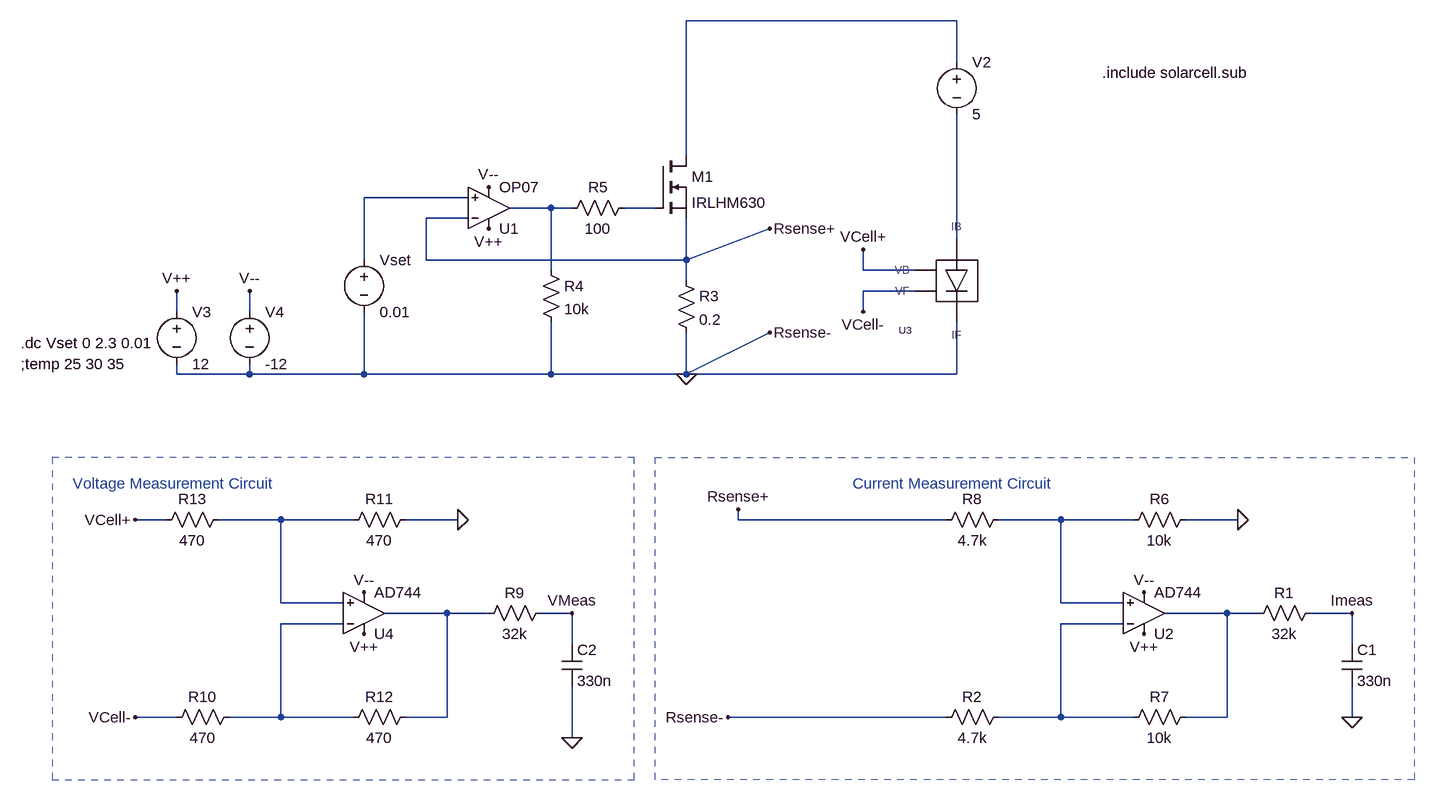
[diagram p0: schematic IVTesterFullCircuit - FIMV.asc]
IVTesterFullCircuit - FIMV.asc, the LTspice schematic file:
Version 4
SHEET 1 1572 1044
WIRE 864 -128 448 -128
WIRE 864 -64 864 -128
WIRE 448 80 448 -128
WIRE 112 144 -48 144
WIRE 240 160 176 160
WIRE 272 160 240 160
WIRE 400 160 352 160
WIRE 112 176 48 176
WIRE 864 208 864 16
WIRE -48 240 -48 144
WIRE 48 240 48 176
WIRE 448 240 448 176
WIRE 448 240 576 192
WIRE 448 240 48 240
WIRE 240 256 240 160
WIRE 720 256 720 224
WIRE 800 256 720 256
WIRE 448 272 448 240
WIRE 800 288 720 288
WIRE -336 320 -336 288
WIRE -224 320 -224 288
WIRE 720 320 720 288
WIRE -336 416 -336 400
WIRE -224 416 -224 400
WIRE -224 416 -336 416
WIRE -48 416 -48 320
WIRE -48 416 -224 416
WIRE 240 416 240 336
WIRE 240 416 -48 416
WIRE 448 416 448 352
WIRE 448 416 576 352
WIRE 448 416 240 416
WIRE 864 416 864 336
WIRE 864 416 448 416
WIRE -352 640 -400 640
WIRE -176 640 -272 640
WIRE -64 640 -176 640
WIRE 96 640 16 640
WIRE 528 640 528 624
WIRE 848 640 528 640
WIRE 1024 640 928 640
WIRE 1136 640 1024 640
WIRE 1296 640 1216 640
WIRE -176 768 -176 640
WIRE -80 768 -176 768
WIRE 1024 768 1024 640
WIRE 1120 768 1024 768
WIRE 80 784 -16 784
WIRE 144 784 80 784
WIRE 272 784 224 784
WIRE 1280 784 1184 784
WIRE 1328 784 1280 784
WIRE 1472 784 1408 784
WIRE -80 800 -176 800
WIRE 1120 800 1024 800
WIRE 272 832 272 784
WIRE 1472 832 1472 784
WIRE -336 944 -400 944
WIRE -176 944 -176 800
WIRE -176 944 -256 944
WIRE -64 944 -176 944
WIRE 80 944 80 784
WIRE 80 944 16 944
WIRE 848 944 512 944
WIRE 1024 944 1024 800
WIRE 1024 944 928 944
WIRE 1136 944 1024 944
WIRE 1280 944 1280 784
WIRE 1280 944 1216 944
WIRE 1472 944 1472 896
WIRE 272 976 272 896
FLAG -336 288 V++
FLAG -224 288 V--
FLAG 144 192 V++
FLAG 144 128 V--
FLAG 448 416 0
FLAG 720 224 VCell+
FLAG 1296 640 0
FLAG 1472 944 0
FLAG 512 944 Rsense-
FLAG 528 624 Rsense+
FLAG 1472 784 Imeas
FLAG 96 640 0
FLAG 272 976 0
FLAG -400 640 VCell+
FLAG 272 784 VMeas
FLAG -400 944 VCell-
FLAG 720 320 VCell-
FLAG 576 192 Rsense+
FLAG 576 352 Rsense-
FLAG -48 816 V++
FLAG 1152 816 V++
FLAG -48 752 V--
FLAG 1152 752 V--
SYMBOL voltage -48 224 R0
WINDOW 123 0 0 Left 0
WINDOW 39 0 0 Left 0
SYMATTR InstName Vset
SYMATTR Value 0.01
SYMBOL voltage 864 -80 R0
WINDOW 123 0 0 Left 0
WINDOW 39 0 0 Left 0
SYMATTR InstName V2
SYMATTR Value 5
SYMBOL res 432 256 R0
SYMATTR InstName R3
SYMATTR Value 0.2
SYMBOL nmos 400 80 R0
SYMATTR InstName M1
SYMATTR Value IRLHM630
SYMBOL OpAmps\\OP07 144 224 M180
SYMATTR InstName U1
SYMBOL voltage -336 304 R0
WINDOW 123 0 0 Left 0
WINDOW 39 0 0 Left 0
SYMATTR InstName V3
SYMATTR Value 12
SYMBOL voltage -224 304 R0
WINDOW 123 0 0 Left 0
WINDOW 39 0 0 Left 0
SYMATTR InstName V4
SYMATTR Value -12
SYMBOL res 224 240 R0
SYMATTR InstName R4
SYMATTR Value 10k
SYMBOL res 368 144 R90
WINDOW 0 0 56 VBottom 2
WINDOW 3 32 56 VTop 2
SYMATTR InstName R5
SYMATTR Value 100
SYMBOL res 1424 768 R90
WINDOW 0 0 56 VBottom 2
WINDOW 3 32 56 VTop 2
SYMATTR InstName R1
SYMATTR Value 32k
SYMBOL cap 1456 832 R0
SYMATTR InstName C1
SYMATTR Value 330n
SYMBOL res 944 928 R90
WINDOW 0 0 56 VBottom 2
WINDOW 3 32 56 VTop 2
SYMATTR InstName R2
SYMATTR Value 4.7k
SYMBOL res 1232 624 R90
WINDOW 0 0 56 VBottom 2
WINDOW 3 32 56 VTop 2
SYMATTR InstName R6
SYMATTR Value 10k
SYMBOL res 1232 928 R90
WINDOW 0 0 56 VBottom 2
WINDOW 3 32 56 VTop 2
SYMATTR InstName R7
SYMATTR Value 10k
SYMBOL OpAmps\\AD744 1152 848 M180
SYMATTR InstName U2
SYMBOL res 944 624 R90
WINDOW 0 0 56 VBottom 2
WINDOW 3 32 56 VTop 2
SYMATTR InstName R8
SYMATTR Value 4.7k
SYMBOL res 240 768 R90
WINDOW 0 0 56 VBottom 2
WINDOW 3 32 56 VTop 2
SYMATTR InstName R9
SYMATTR Value 32k
SYMBOL cap 256 832 R0
SYMATTR InstName C2
SYMATTR Value 330n
SYMBOL res -240 928 R90
WINDOW 0 0 56 VBottom 2
WINDOW 3 32 56 VTop 2
SYMATTR InstName R10
SYMATTR Value 470
SYMBOL res 32 624 R90
WINDOW 0 0 56 VBottom 2
WINDOW 3 32 56 VTop 2
SYMATTR InstName R11
SYMATTR Value 470
SYMBOL res 32 928 R90
WINDOW 0 0 56 VBottom 2
WINDOW 3 32 56 VTop 2
SYMATTR InstName R12
SYMATTR Value 470
SYMBOL OpAmps\\AD744 -48 848 M180
SYMATTR InstName U4
SYMBOL res -256 624 R90
WINDOW 0 0 56 VBottom 2
WINDOW 3 32 56 VTop 2
SYMATTR InstName R13
SYMATTR Value 470
SYMBOL solarcell 864 320 R180
SYMATTR InstName U3
TEXT -576 368 Left 2 !.dc Vset 0 2.3 0.01
TEXT -576 400 Left 2 !;temp 25 30 35
TEXT 704 584 Left 2 ;Current Measurement Circuit
TEXT -496 584 Left 2 ;Voltage Measurement Circuit
TEXT 1088 -48 Left 2 !.include solarcell.sub
RECTANGLE Normal 1568 1040 400 544 2
RECTANGLE Normal -528 1040 368 544 2

The netlist it stands for:
* IVTesterFullCircuit - FIMV.asc
Vset N002 0 0.01
V2 N001 N005 5
R3 Rsense+ 0 0.2
M1 N001 N004 Rsense+ Rsense+ IRLHM630
XU1 N002 Rsense+ V++ V-- N003 LT1001  ; OP07, pins In+ In- V+ V- OUT
V3 V++ 0 12
V4 V-- 0 -12
R4 N003 0 10k
R5 N004 N003 100
R1 Imeas N009 32k
C1 Imeas 0 330n
R2 N011 0 4.7k
R6 0 N007 10k
R7 N009 N011 10k
XU2 N007 N011 V++ V-- N009 AD744  ; pins In+ In- V+ V- OUT
R8 N007 Rsense+ 4.7k
R9 VMeas N008 32k
C2 VMeas 0 330n
R10 N010 VCell- 470
R11 0 N006 470
R12 N008 N010 470
XU4 N006 N010 V++ V-- N008 AD744  ; pins In+ In- V+ V- OUT
R13 N006 VCell+ 470
XU3 0 N005 VCell- VCell+ solarcell  ; pins IF IB VF VB
.model NMOS NMOS
.model PMOS PMOS
.lib standard.mos
.dc Vset 0 2.3 0.01
;temp 25 30 35
* Current Measurement Circuit
* Voltage Measurement Circuit
.include solarcell.sub
.lib LTC.lib
.backanno
.end